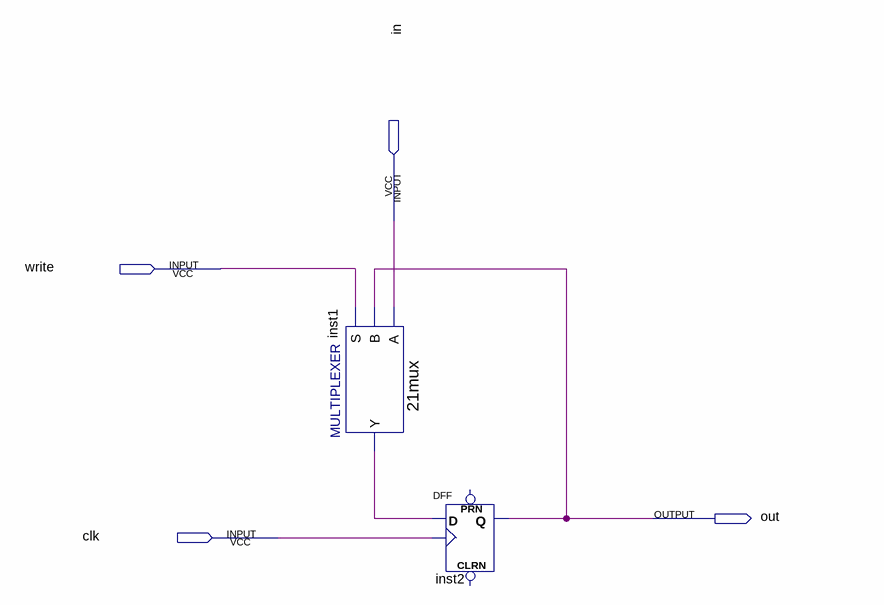
[diagram p0: schematic sheet]
// Quartus schematic REG_1BIT.bdf as structural Verilog: 2 symbols, 4 pins
module REG_1BIT (
  input  in,
  input  write,
  input  clk,
  output out
);

  wire inst1_y;

  \21mux  inst1 (.S(write), .B(out), .A(in), .Y(inst1_y));
  DFF inst2 (.CLK(clk), .D(inst1_y), .Q(out));  // open: CLRN, PRN
endmodule
